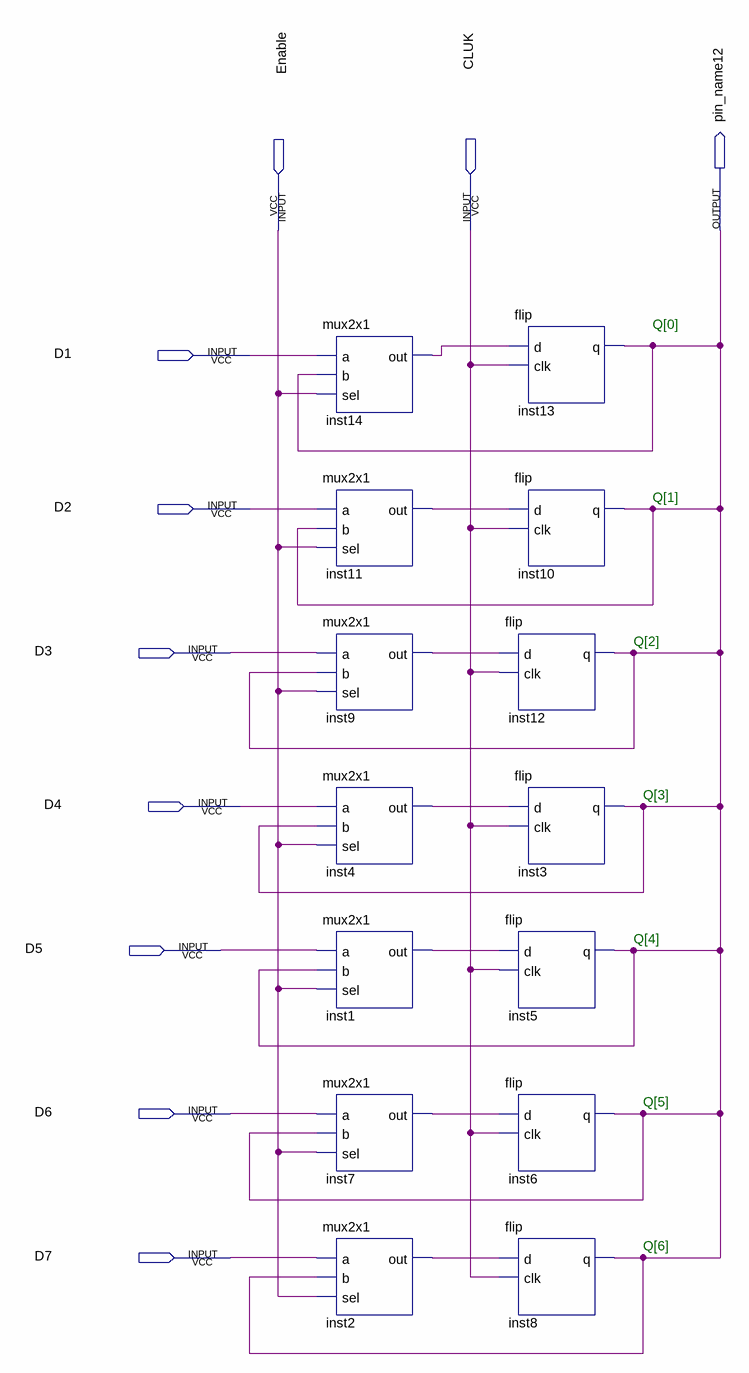
[diagram p0: schematic sheet]
// Quartus schematic memory_system_block.bdf as structural Verilog: 14 symbols, 10 pins
module memory_system_block (
  input  Enable,
  input  CLUK,
  input  D1,
  input  D2,
  input  D3,
  input  D4,
  input  D5,
  input  D6,
  input  D7,
  output pin_name12
);

  wire inst1_out, inst2_out, inst4_out, inst7_out, inst9_out, inst11_out, inst14_out;

  mux2x1 inst14 (.a(D1), .b(pin_name12), .sel(Enable), .out(inst14_out));
  mux2x1 inst11 (.a(D2), .b(pin_name12), .sel(Enable), .out(inst11_out));
  mux2x1 inst9 (.a(D3), .b(pin_name12), .sel(Enable), .out(inst9_out));
  mux2x1 inst4 (.a(D4), .b(pin_name12), .sel(Enable), .out(inst4_out));
  mux2x1 inst1 (.a(D5), .b(pin_name12), .sel(Enable), .out(inst1_out));
  mux2x1 inst7 (.a(D6), .b(pin_name12), .sel(Enable), .out(inst7_out));
  mux2x1 inst2 (.a(D7), .b(pin_name12), .sel(Enable), .out(inst2_out));
  flip inst13 (.d(inst14_out), .clk(CLUK), .q(pin_name12));
  flip inst10 (.d(inst11_out), .clk(CLUK), .q(pin_name12));
  flip inst12 (.d(inst9_out), .clk(CLUK), .q(pin_name12));
  flip inst3 (.d(inst4_out), .clk(CLUK), .q(pin_name12));
  flip inst5 (.d(inst1_out), .clk(CLUK), .q(pin_name12));
  flip inst6 (.d(inst7_out), .clk(CLUK), .q(pin_name12));
  flip inst8 (.d(inst2_out), .clk(CLUK), .q(pin_name12));

  // Notes on the sheet:
  //   Q[0]
  //   Q[1]
  //   Q[2]
  //   Q[3]
  //   Q[4]
  //   Q[5]
  //   Q[6]
endmodule
